# EAGLE design dual_motor_driver_v7 (EAGLE 8.2.2)
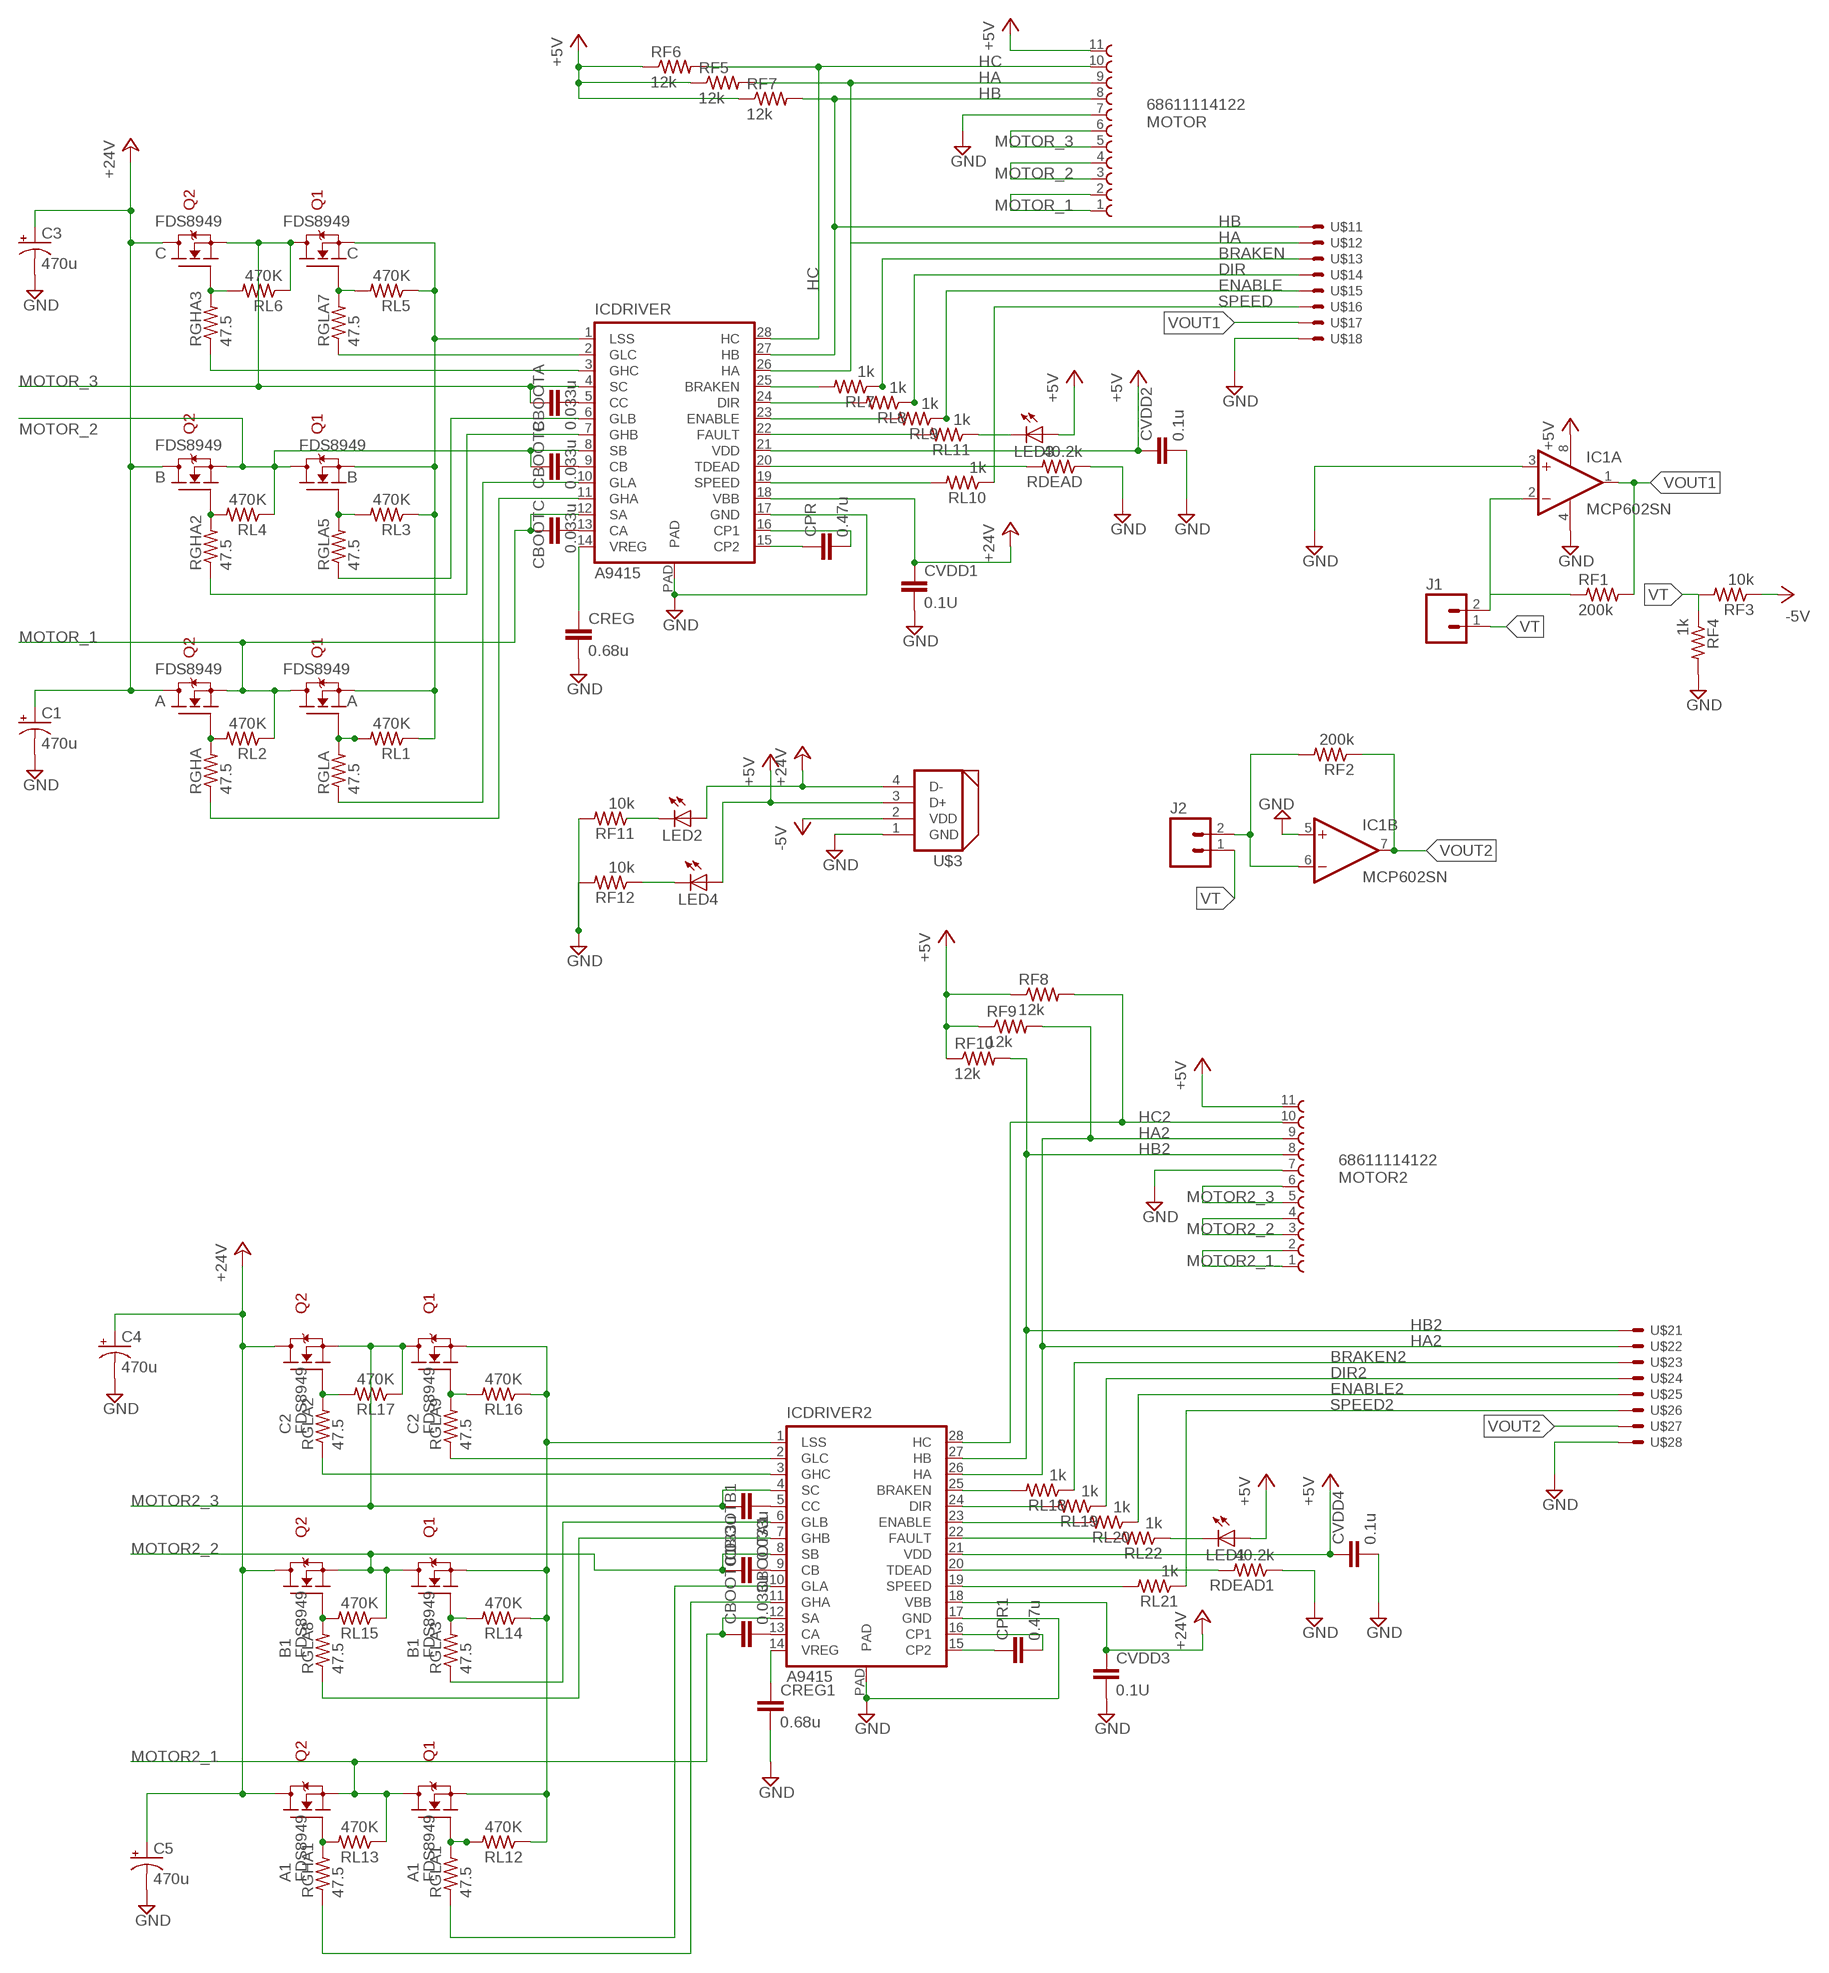
[diagram p0: schematic, sheet 1]

## Parts
A  FDS8949  [SOIC8]
A1  FDS8949  [SOIC8]
B  FDS8949  [SOIC8]
B1  FDS8949  [SOIC8]
C  FDS8949  [SOIC8]
C1  470u  CPOL-US140CLH-1010  [140CLH-1010]
C2  FDS8949  [SOIC8]
C3  470u  CPOL-US140CLH-1010  [140CLH-1010]
C4  470u  CPOL-US140CLH-1010  [140CLH-1010]
C5  470u  CPOL-US140CLH-1010  [140CLH-1010]
CBOOTA  0.033u  C-EUC0805  [C0805]
CBOOTA1  0.033u  C-EUC0805  [C0805]
CBOOTB  0.033u  C-EUC0805  [C0805]
CBOOTB1  0.033u  C-EUC0805  [C0805]
CBOOTC  0.033u  C-EUC0805  [C0805]
CBOOTC1  0.033u  C-EUC0805  [C0805]
CPR  0.47u  C-EUC0805  [C0805]
CPR1  0.47u  C-EUC0805  [C0805]
CREG  0.68u  C-EUC0805  [C0805]
CREG1  0.68u  C-EUC0805  [C0805]
CVDD1  0.1U  C-EUC0805  [C0805]
CVDD2  0.1u  C-EUC0805  [C0805]
CVDD3  0.1U  C-EUC0805  [C0805]
CVDD4  0.1u  C-EUC0805  [C0805]
IC1  MCP602SN  [SO08]
ICDRIVER  A9415  [TSSOP28]
ICDRIVER2  A9415  [TSSOP28]
J1  M02PTH  [1X02]
J2  M02PTH  [1X02]
LED1  LEDCHIPLED_0805  [CHIPLED_0805]
LED2  LEDCHIPLED_0805  [CHIPLED_0805]
LED3  LEDCHIPLED_0805  [CHIPLED_0805]
LED4  LEDCHIPLED_0805  [CHIPLED_0805]
MOTOR  68611114122  [68611114122]
MOTOR2  68611114122  [68611114122]
RDEAD  40.2k  R-US_R0805  [R0805]
RDEAD1  40.2k  R-US_R0805  [R0805]
RF1  200k  R-US_R0805  [R0805]
RF2  200k  R-US_R0805  [R0805]
RF3  10k  R-US_R0805  [R0805]
RF4  1k  R-US_R0805  [R0805]
RF5  12k  R-US_R0805  [R0805]
RF6  12k  R-US_R0805  [R0805]
RF7  12k  R-US_R0805  [R0805]
RF8  12k  R-US_R0805  [R0805]
RF9  12k  R-US_R0805  [R0805]
RF10  12k  R-US_R0805  [R0805]
RF11  10k  R-US_R0805  [R0805]
RF12  10k  R-US_R0805  [R0805]
RGHA  47.5  R-US_R0805  [R0805]
RGHA1  47.5  R-US_R0805  [R0805]
RGHA2  47.5  R-US_R0805  [R0805]
RGHA3  47.5  R-US_R0805  [R0805]
RGLA  47.5  R-US_R0805  [R0805]
RGLA1  47.5  R-US_R0805  [R0805]
RGLA2  47.5  R-US_R0805  [R0805]
RGLA3  47.5  R-US_R0805  [R0805]
RGLA5  47.5  R-US_R0805  [R0805]
RGLA7  47.5  R-US_R0805  [R0805]
RGLA8  47.5  R-US_R0805  [R0805]
RGLA9  47.5  R-US_R0805  [R0805]
RL1  470K  R-US_R0805  [R0805]
RL2  470K  R-US_R0805  [R0805]
RL3  470K  R-US_R0805  [R0805]
RL4  470K  R-US_R0805  [R0805]
RL5  470K  R-US_R0805  [R0805]
RL6  470K  R-US_R0805  [R0805]
RL7  1k  R-US_R0805  [R0805]
RL8  1k  R-US_R0805  [R0805]
RL9  1k  R-US_R0805  [R0805]
RL10  1k  R-US_R0805  [R0805]
RL11  1k  R-US_R0805  [R0805]
RL12  470K  R-US_R0805  [R0805]
RL13  470K  R-US_R0805  [R0805]
RL14  470K  R-US_R0805  [R0805]
RL15  470K  R-US_R0805  [R0805]
RL16  470K  R-US_R0805  [R0805]
RL17  470K  R-US_R0805  [R0805]
RL18  1k  R-US_R0805  [R0805]
RL19  1k  R-US_R0805  [R0805]
RL20  1k  R-US_R0805  [R0805]
RL21  1k  R-US_R0805  [R0805]
RL22  1k  R-US_R0805  [R0805]
U$1  JST8  [JST]
U$2  JST8  [JST]
U$3  DYNAMIXEL_RS485  [DYNAMIXEL_SPOX_04]

## Nets
+5V: CVDD2.1 CVDD4.1 IC1.8(P:V+) ICDRIVER2.21(VDD) ICDRIVER.21(VDD) LED1.A LED3.A LED4.A MOTOR2.11 MOTOR.11 RF5.1 RF6.1 RF7.1 RF8.1 RF9.1 RF10.1 U$3.3(D+)
+24V: A1.5(D2) A1.6(D2) A.5(D2) A.6(D2) B1.5(D2) B1.6(D2) B.5(D2) B.6(D2) C1.+ C2.5(D2) C2.6(D2) C3.+ C4.+ C5.+ C.5(D2) C.6(D2) CVDD1.1 CVDD3.1 ICDRIVER2.18(VBB) ICDRIVER.18(VBB) LED2.A U$3.4(D-)
-5V: RF3.1 U$3.2(VDD)
BRAKEN: RL7.1 U$1.3
BRAKEN2: RL18.1 U$2.3
DIR: RL8.1 U$1.4
DIR2: RL19.1 U$2.4
ENABLE: RL9.1 U$1.5
ENABLE2: RL20.1 U$2.5
GND: A1.1(S1) A.1(S1) B1.1(S1) B.1(S1) C1.- C2.1(S1) C3.- C4.- C5.- C.1(S1) CREG1.2 CREG.2 CVDD1.2 CVDD2.2 CVDD3.2 CVDD4.2 IC1.3(A:+IN) IC1.4(P:V-) IC1.5(B:+IN) ICDRIVER2.1(LSS) ICDRIVER2.17(GND) ICDRIVER2.PAD ICDRIVER.1(LSS) ICDRIVER.17(GND) ICDRIVER.PAD MOTOR2.7 MOTOR.7 RDEAD1.1 RDEAD.1 RF4.2 RF11.2 RF12.2 RL1.1 RL3.1 RL5.1 RL12.1 RL14.1 RL16.1 U$1.8 U$2.8 U$3.1(GND)
HA: ICDRIVER.26(HA) MOTOR.9 RF5.2 U$1.2
HA2: ICDRIVER2.26(HA) MOTOR2.9 RF9.2 U$2.2
HB: ICDRIVER.27(HB) MOTOR.8 RF7.2 U$1.1
HB2: ICDRIVER2.27(HB) MOTOR2.8 RF10.2 U$2.1
HC: ICDRIVER.28(HC) MOTOR.10 RF6.2
HC2: ICDRIVER2.28(HC) MOTOR2.10 RF8.2
MOTOR2_1: A1.3(S2) A1.7(D1) A1.8(D1) CBOOTC1.1 ICDRIVER2.12(SA) MOTOR2.1 MOTOR2.2 RL13.1
MOTOR2_2: B1.3(S2) B1.7(D1) B1.8(D1) CBOOTB1.1 ICDRIVER2.8(SB) MOTOR2.3 MOTOR2.4 RL15.1
MOTOR2_3: C2.3(S2) C2.7(D1) C2.8(D1) CBOOTA1.2 ICDRIVER2.4(SC) MOTOR2.5 MOTOR2.6 RL17.1
MOTOR_1: A.3(S2) A.7(D1) A.8(D1) CBOOTC.1 ICDRIVER.12(SA) MOTOR.1 MOTOR.2 RL2.1
MOTOR_2: B.3(S2) B.7(D1) B.8(D1) CBOOTB.1 ICDRIVER.8(SB) MOTOR.3 MOTOR.4 RL4.1
MOTOR_3: C.3(S2) C.7(D1) C.8(D1) CBOOTA.2 ICDRIVER.4(SC) MOTOR.5 MOTOR.6 RL6.1
N$1: A1.2(G1) RGLA1.2 RL12.2
N$2: A1.4(G2) RGHA1.2 RL13.2
N$3: B1.2(G1) RGLA3.2 RL14.2
N$4: B1.4(G2) RGLA8.2 RL15.2
N$5: C2.2(G1) RGLA9.2 RL16.2
N$6: C2.4(G2) RGLA2.2 RL17.2
N$7: B.2(G1) RGLA5.2 RL3.2
N$8: B.4(G2) RGHA2.2 RL4.2
N$9: ICDRIVER2.11(GHA) RGHA1.1
N$10: ICDRIVER2.10(GLA) RGLA1.1
N$11: ICDRIVER2.6(GLB) RGLA3.1
N$12: ICDRIVER2.7(GHB) RGLA8.1
N$13: CBOOTA1.1 ICDRIVER2.5(CC)
N$14: CBOOTB1.2 ICDRIVER2.9(CB)
N$15: C.2(G1) RGLA7.2 RL5.2
N$16: CPR.1 ICDRIVER.15(CP2)
N$17: ICDRIVER.11(GHA) RGHA.1
N$18: C.4(G2) RGHA3.2 RL6.2
N$19: CREG1.1 ICDRIVER2.14(VREG)
N$20: ICDRIVER.10(GLA) RGLA.1
N$21: CREG.1 ICDRIVER.14(VREG)
N$22: CBOOTC.2 ICDRIVER.13(CA)
N$23: CBOOTC1.2 ICDRIVER2.13(CA)
N$24: ICDRIVER.2(GLC) RGLA7.1
N$25: ICDRIVER.6(GLB) RGLA5.1
N$26: ICDRIVER.7(GHB) RGHA2.1
N$27: ICDRIVER.3(GHC) RGHA3.1
N$28: CBOOTB.2 ICDRIVER.9(CB)
N$29: CPR.2 ICDRIVER.16(CP1)
N$30: ICDRIVER2.2(GLC) RGLA9.1
N$31: CBOOTA.1 ICDRIVER.5(CC)
N$32: A.2(G1) RGLA.2 RL1.2
N$33: A.4(G2) RGHA.2 RL2.2
N$34: ICDRIVER2.3(GHC) RGLA2.1
N$35: CPR1.1 ICDRIVER2.15(CP2)
N$36: CPR1.2 ICDRIVER2.16(CP1)
N$37: ICDRIVER2.19(SPEED) RL21.2
N$38: ICDRIVER2.23(ENABLE) RL20.2
N$39: ICDRIVER2.24(DIR) RL19.2
N$40: ICDRIVER.19(SPEED) RL10.2
N$41: ICDRIVER.23(ENABLE) RL9.2
N$42: ICDRIVER.24(DIR) RL8.2
N$43: ICDRIVER2.25(BRAKEN) RL18.2
N$44: ICDRIVER.25(BRAKEN) RL7.2
N$45: ICDRIVER.20(TDEAD) RDEAD.2
N$46: ICDRIVER.22(FAULT) RL11.2
N$47: LED3.C RL11.1
N$48: LED2.C RF11.1
N$49: ICDRIVER2.20(TDEAD) RDEAD1.2
N$50: ICDRIVER2.22(FAULT) RL22.2
N$51: LED1.C RL22.1
N$52: IC1.2(A:-IN) J1.2 RF1.1
N$59: LED4.C RF12.1
N$82: IC1.6(B:-IN) J2.2 RF2.2
SPEED: RL10.1 U$1.6
SPEED2: RL21.1 U$2.6
VOUT1: IC1.1(A:OUT) RF1.2 U$1.7
VOUT2: IC1.7(B:OUT) RF2.1 U$2.7
VT: J1.1 J2.1 RF3.2 RF4.1

## Library data of the parts
A A1 B B1 C C2 = dedo:FDS8949: Dual N-Channel PowerTrench® MOSFET https://www.fairchildsemi.com/datasheets/FD/FDS8949.pdf
C1 C3-C5 = resistor:CPOL-US: POLARIZED CAPACITOR, American symbol
CBOOTA CBOOTA1 CBOOTB CBOOTB1 CBOOTC CBOOTC1 CPR CPR1 CREG CREG1 CVDD1-CVDD4 = resistor:C-EU: CAPACITOR, European symbol
IC1 = dedo:MCP602: Single Op Amp 2.7V to 6.0V Single Supply CMOS Source: http://ww1.microchip.com/downloads/en/DeviceDoc/21314g.pdf
ICDRIVER ICDRIVER2 = dedo:A9415: A4915 3-Phase MOSFET Driver The A4915 is designed for pulse width modulated (PWM) current control of 3-phase brushless DC motors. The A4915 is capable of high current gate drive for 6 all N-channel power MOSFETs. An internal charge pump ensures gate drive down to 7 V supply and provides limited gate drive down to 5 V. A bootstrap capacitor is used to generate a supply voltage greater than the source voltage of the high side MOSFET, required for N-channel MOSFETs. Details see: http://www.allegromicro.com/~/media/Files/Datasheets/A4915-Datasheet.ashx?la=en
J1 J2 = uchile_robotics_eagle_lib:M02: Standard 2-pin 0.1" header. Use with - straight break away headers ( PRT-00116) - right angle break away headers (PRT-00553) - swiss pins (PRT-00743) - machine pins (PRT-00117) - female headers (PRT-00115) Molex polarized connector foot print use with: PRT-08233 with associated crimp pins and housings. 2.54_SCREWTERM for use with PRT-10571. 3.5mm Screw Terminal footprints for PRT-08084 5mm Screw Terminal footprints for use with PRT-08432
LED1-LED4 = adafruit:LED: LED OSRAM: - CHIPLED LG R971, LG N971, LY N971, LG Q971, LY Q971, LO R971, LY R971 LH N974, LH R974 LS Q976, LO Q976, LY Q976 LO Q996 - Hyper CHIPLED LW Q18S LB Q993, LB Q99A, LB R99A - SideLED LS A670, LO A670, LY A670, LG A670, LP A670 LB A673, LV A673, LT A673, LW A673 LH A674 LY A675 LS A676, LA A676, LO A676, LY A676, LW A676 LS A679, LY A679, LG A679 - Hyper Micro SIDELED® LS Y876, LA Y876, LO Y876, LY Y876 LT Y87S - SmartLED LW L88C, LW L88S LB L89C, LB L89S, LG L890 LS L89K, LO L89K, LY L89K LS L896, LA L896, LO L896, LY L896 - TOPLED LS T670, LO T670, LY T670, LG T670, LP T670 LSG T670, LSP T670, LSY T670, LOP T670, LYG T670 LG T671, LOG T671, LSG T671 LB T673, LV T673, LT T673, LW T673 LH T674 LS T676, LA T676, LO T676, LY T676, LB T676, LH T676, LSB T676, LW T676 LB T67C, LV T67C, LT T67C, LS T67K, LO T67K, LY T67K, LW E67C LS E67B, LA E67B, LO E67B, LY E67B, LB E67C, LV E67C, LT E67C LW T67C LS T679, LY T679, LG T679 LS T770, LO T770, LY T770, LG T770, LP T770 LB T773, LV T773, LT T773, LW T773 LH T774 LS E675, LA E675, LY E675, LS T675 LS T776, LA T776, LO T776, LY T776, LB T776 LHGB T686 LT T68C, LB T68C - Hyper Mini TOPLED® LB M676 - Mini TOPLED Santana® LG M470 LS M47K, LO M47K, LY M47K Source: http://www.osram.convergy.de/
MOTOR MOTOR2 = FPC_Connectors_Flat_Flexible_Cable_rev15c:68611114122: WR-FPC 1.00mm SMT ZIF Horizontal Top Contact, 11 Pins=>Code : Con_FPC_ZIF_1.00_68611114122 <http://katalog.we-online.de/media/images/eican/Con_FPC_ZIF_1.00_6861xx14122_pf2.jpg> Details see: http://katalog.we-online.de/en/em/686_1xx_141_22 Created 2014-07-09, Karrer Zheng 2014 (C) Würth Elektronik
RDEAD RDEAD1 RF1-RF12 RGHA RGHA1-RGHA3 RGLA RGLA1-RGLA3 RGLA5 RGLA7-RGLA9 RL1-RL22 = resistor:R-US_: RESISTOR, American symbol
U$1 U$2 = dedo:JST8
U$3 = uchile_robotics_eagle_lib:DYNAMIXEL_RS485: Dynamixel RS-485 Connector Molex LLC SPOX 4 Male connector Digikey code: WM18888-ND

## Net classes
0 default: clearance 0.205 mm

## Board
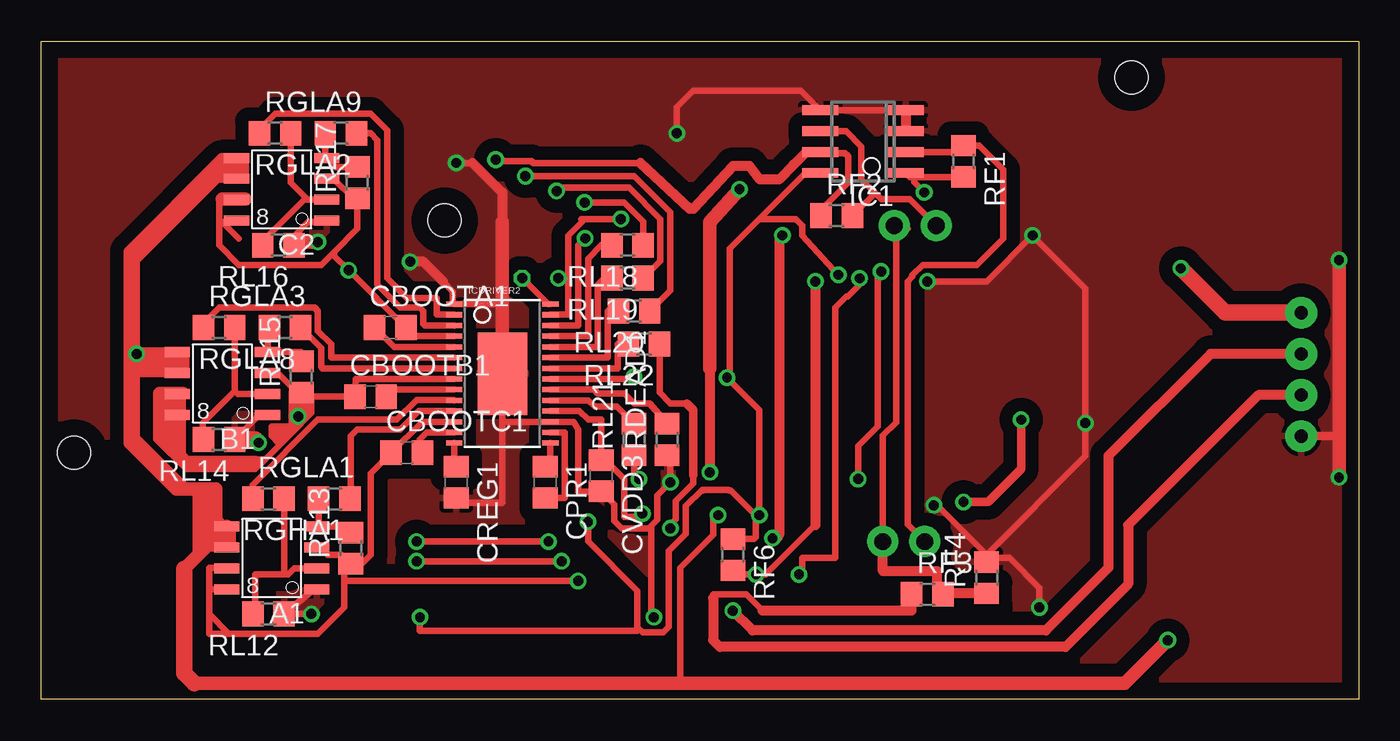
[diagram p1: board, top side]
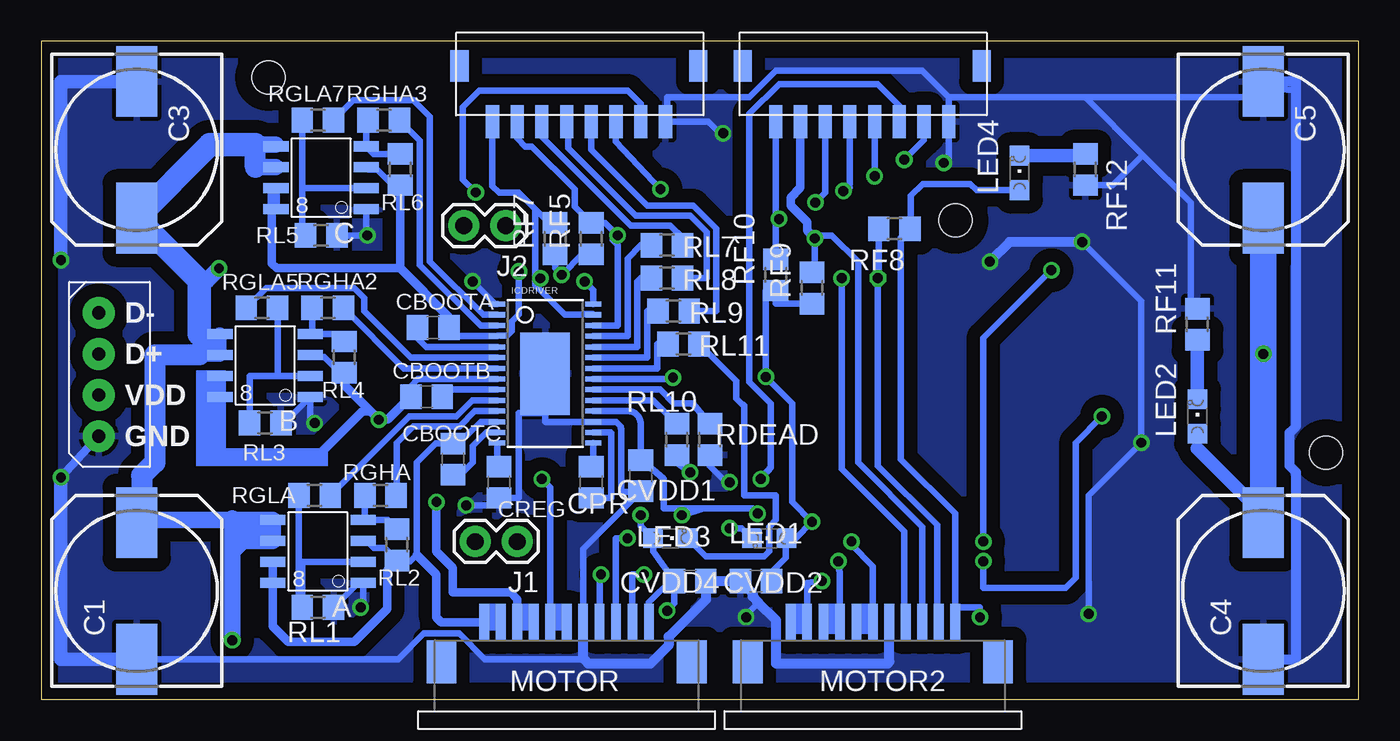
[diagram p2: board, bottom side, seen from below]

Size 80 x 40 mm. Coordinates in mm from the lower left corner, seen from the top.
Outline: 80,0 0,0 0,40 80,40 80,0
Copper layers (1*16): Top 0.035mm / dielectric 1.5mm / Bottom 0.035mm
Design rules "Dedo_v5": minimum track width 10mil, minimum drill 24mil, track to track 0.205mm, track to pad 0.205mm, pad to pad 0.205mm, via to via 0.205mm, smd to smd 8mil, copper to edge 40mil, drill to drill 8mil, minimum pad ring 10mil, minimum via ring 8mil, stop-mask expansion 4mil, vias tented up to drill 0mil, thermal gap 10mil
Holes 2 mm at 66.2,37.8 2,15 24.5,29.1

### Footprints (pad centres in the part's own frame; a part is rotated, then mirrored left to right if it is on the bottom)
SOIC8 = smd 1.524 x 0.61: 1 -2.743,1.905; 2 -2.743,0.635; 3 -2.743,-0.635; 4 -2.743,-1.905; 5 2.743,-1.905; 6 2.743,-0.635; 7 2.743,0.635; 8 2.743,1.905
140CLH-1010 = smd 4.3 x 2.5: + 4.15,0; - -4.15,0
C0805 = smd 1.3 x 1.5: 1 -0.95,0; 2 0.95,0
SO08 = smd 0.6 x 2.2: 1 -1.905,-2.6; 2 -0.635,-2.6; 3 0.635,-2.6; 4 1.905,-2.6; 5 1.905,2.6; 6 0.635,2.6; 7 -0.635,2.6; 8 -1.905,2.6
TSSOP28 = smd 0.305 x 0.991: 1 -4.225,-2.918; 2 -3.575,-2.918; 3 -2.925,-2.918; 4 -2.275,-2.918; 5 -1.625,-2.918; 6 -0.975,-2.918; 7 -0.325,-2.918; 8 0.325,-2.918; 9 0.975,-2.918; 10 1.625,-2.918; 11 2.275,-2.918; 12 2.925,-2.918; 13 3.575,-2.918; 14 4.225,-2.918; 15 4.225,2.918; 16 3.575,2.918; 17 2.925,2.918; 18 2.275,2.918; 19 1.625,2.918; 20 0.975,2.918; 21 0.325,2.918; 22 -0.325,2.918; 23 -0.975,2.918; 24 -1.625,2.918; 25 -2.275,2.918; 26 -2.925,2.918; 27 -3.575,2.918; 28 -4.225,2.918 | smd 5 x 3: PAD 0,0
1X02 = drill 1.016 pad 1.88: 1 0,0; 2 2.54,0
CHIPLED_0805 = smd 1.2 x 1.2: A 0,-1.05; C 0,1.05
68611114122 = smd 0.6 x 2.2: 1 -8.5,1.1; 2 -7.5,1.1; 3 -6.5,1.1; 4 -5.5,1.1; 5 -4.5,1.1; 6 -3.5,1.1; 7 -2.5,1.1; 8 -1.5,1.1; 9 -0.5,1.1; 10 0.5,1.1; 11 1.5,1.1 | smd 1.8 x 2.6: Z1 -11.1,-1.3; Z2 4.1,-1.3
R0805 = smd 1.3 x 1.5: 1 -0.95,0; 2 0.95,0
JST = smd 0.8 x 2: 1 -4.8,-2.7; 2 -3.3,-2.7; 3 -1.8,-2.7; 4 -0.3,-2.7; 5 1.2,-2.7; 6 2.7,-2.7; 7 4.2,-2.7; 8 5.7,-2.7 | smd 1.1 x 1.9: 9 -6.8,0.7; 10 7.7,0.7
DYNAMIXEL_SPOX_04 = drill 0.8 pad 1.93: 1 0,0; 2 2.5,0; 3 5,0; 4 7.5,0

### Placement (x,y rotation side)
A  63.2,9 180 bottom
A1  14,8.6 180 top
B  66.4,20.3 180 bottom
B1  11,19.2 180 top
C  63,31.7 180 bottom
C1  74.2,6.6 90 bottom
C2  14.6,31 180 top
C3  74.2,33.4 270 bottom
C4  5.8,6.6 90 bottom
C5  5.8,33.4 270 bottom
CBOOTA  56.2,22.6 0 bottom
CBOOTA1  21.2,22.6 0 top
CBOOTB  56.6,18.4 0 bottom
CBOOTB1  20,18.4 0 top
CBOOTC  55,14.6 270 bottom
CBOOTC1  22.2,15 0 top
CPR  46.6,13.2 270 bottom
CPR1  30.6,13.2 270 top
CREG  52.2,13.2 270 bottom
CREG1  25.2,13.2 270 top
CVDD1  43.6,13.6 270 bottom
CVDD2  36.6,7.2 180 bottom
CVDD3  34,13.6 270 top
CVDD4  40.6,7.2 0 bottom
IC1  49.9,33.9 90 top
ICDRIVER  49.4,19.8 270 bottom
ICDRIVER2  28,19.8 270 top
J1  51.1,9.6 180 bottom
J2  51.8,28.8 180 bottom
LED1  35.8,9.8 90 bottom
LED2  9.8,17.2 0 bottom
LED3  41.8,9.8 270 bottom
LED4  20.6,32 0 bottom
MOTOR  44.6,3.6 0 bottom
MOTOR2  26,3.6 0 bottom
RDEAD  39.4,15.8 90 bottom
RDEAD1  38,15.8 90 top
RF1  56,32.7 270 top
RF2  48.3,29.4 0 top
RF3  53.8,6.4 0 top
RF4  57.4,7.4 90 top
RF5  46.6,28 90 bottom
RF6  42,8.8 270 top
RF7  48.8,28 90 bottom
RF8  28.2,28.6 180 bottom
RF9  33.2,25 90 bottom
RF10  35.4,25.8 90 bottom
RF11  9.8,22.8 90 bottom
RF12  16.6,32.2 270 bottom
RGHA  59.4,12.4 180 bottom
RGHA1  17.8,12.2 180 top
RGHA2  62.6,23.8 180 bottom
RGHA3  59.2,35.2 180 bottom
RGLA  63.4,12.4 180 bottom
RGLA1  13.8,12.2 0 top
RGLA2  18.2,34.4 180 top
RGLA3  10.8,22.6 0 top
RGLA5  66.6,23.8 0 bottom
RGLA7  63.2,35.2 180 bottom
RGLA8  14.8,22.6 180 top
RGLA9  14.2,34.4 0 top
RL1  63.2,5.6 180 bottom
RL2  58.4,9.4 90 bottom
RL3  66.4,16.8 180 bottom
RL4  61.6,20.8 90 bottom
RL5  63,28.2 180 bottom
RL6  58.2,32.2 90 bottom
RL7  42,27.6 180 bottom
RL8  42,25.6 180 bottom
RL9  41.6,23.6 180 bottom
RL10  41.4,15.8 90 bottom
RL11  41,21.6 180 bottom
RL12  13.8,5.2 180 top
RL13  18.8,9.2 90 top
RL14  10.8,15.8 180 top
RL15  15.8,19.6 90 top
RL16  14.4,27.6 180 top
RL17  19.2,31.4 90 top
RL18  35.6,27.6 180 top
RL19  35.6,25.6 180 top
RL20  36,23.6 180 top
RL21  36,15.8 90 top
RL22  36.6,21.6 180 top
U$1  47.8,37.8 0 bottom
U$2  30.6,37.8 0 bottom
U$3  76.5,16 90 bottom

### Tracks (layer width: path | path; a pad name or v marks a point on that pad's centre or on a via)
+5V  (via drill 0.6)
  Top 0.406: 36.2,4.4 36.2,4.17 23,4.17 v23,5 | 36.2,4.4 36.2,6.61 33.2,9.61 v33.2,10.8 | 43.4,11.19 43.59,11 43.4,11 v43.6,11.2 43.6,17.6 v41.64,19.56 41.8,19.72 41.8,27.4 43.6,29.2 | 43.4,11.19 41.88,12.71 41.74,12.71 41.73,12.72 40.12,12.72 40.11,12.71 | ICDRIVER2.21 35.88,19.48 v36,19.6 | 36.2,4.4 36.51,4.09 37.78,4.09 38.11,4.42 38.11,9.02 39.15,10.06 39.15,11.75 40.11,12.71 | 40.11,12.71 40.2,12.71 | IC1.8 46.4,32 43.6,29.2 | 43.6,29.2 45.8,29.2 46.2,28.8 46.2,28.2 v48.4,25.8 | 43.4,11.19 43.4,9.85 43.3,9.75 RF6.1
  Top 0.61: U$3.3 71,21 64.8,14.8 64.8,8 61,4.2 43.2,4.2 v42,5.4
  Bottom 0.406: 41.66,7.34 42.85,9 LED3.A 43.6,10.55 v43.6,11.2 | 41.66,7.34 CVDD4.1 41.55,5.85 v42,5.4 | MOTOR.11 43.1,5.9 41.66,7.34 | CVDD2.1 35.65,7.75 34.8,8.6 34.8,9.75 LED1.A 34.2,9.8 v33.2,10.8 34.4,12 34.4,18 v36,19.6 36,24.85 RF10.1 35.4,24.05 RF9.1 | ICDRIVER.21 41.73,19.48 v41.64,19.56 | v48.4,25.8 48.6,26 | v23,5 23,5.6 24.5,5.6 MOTOR2.11 24.5,11.3 27.8,14.6 27.8,28.05 RF8.1 27.2,28.65 27.2,30.6 26.48,31.32 23.58,31.32 23.21,30.95 LED4.A | RF7.1 48.8,26.2 v48.4,25.8 | RF5.1 47.15,27.05 v48.4,25.8
+24V  (via drill 0.6)
  Top 0.406: B1.6 7.2,19.84 7.2,21 | 7.2,21 8.26,21 B1.5 | C2.6 10.8,31.64 | 10.8,31.64 10.8,32.8 11.86,32.8 C2.5 | 7.2,21 v5.8,21 | v5.8,21 5.8,15.96 A1.5 10.2,10.51 10.2,9.2 11.26,9.2 A1.6 | 10.8,31.64 5.8,26.64 v5.8,21 | ICDRIVER2.18 32.67,17.52 33.2,17 34,17 CVDD3.1 34.45,14.35 35.4,13.4 35.4,11.1 36.3,11.1 v36.5,11.3 | 41,1 41.03,1 | 38.8,1 38.8,8 40.8,10 40.8,10.9 v41.1,11.2
  Top 0.813: A1.5 8.7,7.95 | 9.3,1 38.8,1 41,1 | 41.03,1 65.8,1 v68.4,3.6
  Top 1.016: 8.7,7.95 8.7,1.6 9.3,1 | U$3.4 71.9,23.5 v69.2,26.2
  Bottom 0.406: 65.74,33.7 C.5 | 67,9.63 A.6 | 65.94,11 A.5 | C1.+ 73.95,11 73.66,11 68.4,11 65.94,11 | C5.+ v5.8,21 5.8,11.67 | 5.8,11.67 C4.+ | 39.8,11.6 42.2,11.6 42.2,13.4 42.65,13.8 CVDD1.1 43.6,16.75 arc-90 44.38,17.52 ICDRIVER.18 | 39.8,11.6 v41.1,11.2 | 39.8,11.6 36.8,11.6 v36.5,11.3 | 65.94,11 | 65.94,11 68.4,8.54 | 6.54,11.98 6.11,11.98 5.8,11.67 | LED2.A 9.8,15.25
  Bottom 0.813: 70.4,22.2 70.4,20.93 B.6 B.5 | 73.9,10.75 C1.+ | 9.8,15.25 6.54,11.98
  Bottom 1.016: C.6 67,32.34 | 67,33.7 65.74,33.7 | 70.4,25.45 69.95,25.45 v69.2,26.2 | 68.4,9.58 68.4,8.54 v68.4,3.6 | 68.4,10.27 68.4,9.58 | 68.4,10.27 68.4,11 | 65.94,10.4 A.5 73.57,10.9 73.66,11 | 65.94,10.4 A.6 68.34,9.63 68.4,9.58 | 65.94,10.4 68.27,10.4 68.4,10.27
  Bottom 1.27: 67,32.34 67,33.7 | 73.9,10.75 73.9,13.6 73.1,14.4 73.1,20.93 70.4,20.93
  Bottom 1.422: 67,33.7 69.75,33.7 C3.+ 70.4,25.45 70.4,22.2
-5V
  Top 0.406: 43.8,5.4 42.8,6.4 40.8,6.4 40.8,6.17
  Top 0.61: U$3.2 73.9,18.5 66,10.6 66,7 62.2,3.2 41.2,3.2 40.8,3.6 40.8,6.17 | 43.8,5.4 52.85,5.4 RF3.1
BRAKEN
  Bottom 0.406: RL7.1 41.05,28.05 41.8,28.8 44.2,28.8 49.6,34.2 U$1.3
BRAKEN2  (via drill 0.6)
  Top 0.406: RL18.1 36.55,29.05 35.4,30.2 v33,30.2
  Bottom 0.406: v33,30.2 32.4,30.8 U$2.3
DIR
  Bottom 0.406: RL8.1 39.6,25.6 39.6,28.4 40.6,29.4 43.9,29.4 48,33.5 48,35 U$1.4
DIR2  (via drill 0.6)
  Top 0.406: RL19.1 37.6,26.65 37.6,29.2 35.7,31.1 31.5,31.1 v31.3,30.9
  Bottom 0.406: 30.9,31.1 v31.3,30.9 30.9,31.3 U$2.4
ENABLE
  Bottom 0.406: RL9.1 39,23.6 39,28.6 40.4,30 43.2,30 46.6,33.4 U$1.5
ENABLE2  (via drill 0.6)
  Top 0.406: RL20.1 38.2,24.85 38.2,29.6 36,31.8 v29.4,31.8
  Bottom 0.406: v29.4,31.8 U$2.5
GND  (via drill 0.6)
  Top 0.152: 54.6,12 54.4,11.8
  Top 0.406: 28,16.88 28,11.95 25.5,11.95 CREG1.2 | 28,16.88 ICDRIVER2.PAD | 28,16.88 ICDRIVER2.17 32.33,16.88 32.6,16.4 32.6,12.6 33.75,12.6 CVDD3.2 34.79,11.86 34.79,10.85 35.25,10.39 36.88,10.39 37.04,10.56 | 26.2,32.6 v25.2,32.6 | RDEAD1.1 38.2,14.65 v38.2,13.2 37.41,12.41 37.41,10.92 37.04,10.56 | 37.04,10.56 37.04,5.16 v37.2,5 | v38.6,34.4 38.6,36 39.6,37 46.1,37 IC1.5 IC1.4 | 57.4,8.8 RF4.2 57.65,8.6 58.8,8.6 60.6,6.8 v60.6,5.6 | 57.4,8.8 54.4,11.8 v54.2,11.8 | A1.1 16.55,6.7 RL12.1 v16.4,5.2 | B1.1 13.24,17.3 RL14.1 | C2.1 17.25,29 16.2,29 15.35,28.15 RL16.1 15.55,27.8 | v13.2,15.6 13,15.8 | 24.4,25.4 25,24.8 25,24.11 ICDRIVER2.1 27.86,24.02 28,23.89 | v53.8,25.4 57.4,25.4 60.18,28.18 | 60.18,28.18 v60.2,28.2 | 57.4,8.8 63.4,14.8 v63.4,16.8 63.4,24.96 60.18,28.18
  Top 0.508: 78.78,16 U$3.1
  Top 0.61: 26.2,32.6 28,30.8 28,29 | IC1.4 IC1.3 | 24.4,25.4 23.2,26.6 v22.4,26.6
  Top 0.813: 28,29 28,23.89 ICDRIVER2.PAD | v78.8,26.7 v78.8,13.5 | 15.55,27.8 v16.8,27.8
  Top 1.016: 13,15.8 RL14.1
  Bottom 0.406: 24.9,36.6 U$2.8 24.9,32.9 v25.2,32.6 | 16.62,36.6 24.9,36.6 | 16.62,36.6 6.75,36.6 C5.- 5.8,37.2 3.8,37 | 24.9,36.6 26.5,38.2 35.4,38.2 37,36.6 42,36.6 42,35.1 U$1.8 39.5,35.1 38.8,34.4 v38.6,34.4 | 49.4,17.4 ICDRIVER.PAD | 49.4,17.4 49.4,16.88 ICDRIVER.17 45.08,16.88 44.8,16.6 44.8,16.46 44.79,16.45 44.79,12.6 43.6,12.6 CVDD1.2 47.1,9.15 MOTOR.7 | 49.4,17.4 51,17.4 51,12.25 CREG.2 52.65,11.8 v54.2,11.8 | RDEAD.1 39.4,14.2 38.4,13.2 v38.2,13.2 | v37.2,5 37.2,5.13 36.45,5.88 | 46.8,2.2 47.05,2.45 53.07,2.45 54.63,4.01 56.77,4.01 58.33,2.45 C1.- | RL3.1 65.25,16.8 B.1 63.66,17.06 v63.4,16.8 | 13.11,33.09 10.2,30.18 10.2,24.15 RF11.2 | 13.11,33.09 16.62,36.6 | RF12.2 14.94,31.25 13.11,33.09 | v16.8,27.8 13.2,24.2 v13.2,15.6 16.4,12.4 v16.4,5.2 | RL1.1 60.76,7.09 A.1 60.46,5.74 v60.6,5.6 | ICDRIVER.1 52.42,24.02 v53.8,25.4 | C.1 60.26,28.26 v60.2,28.2 RL5.1
  Bottom 0.508: v78.8,13.5 U$3.1
  Bottom 0.61: C4.- 3.8,2.45 3.8,13.8 4.2,14.2 4.2,16.2 3.8,16.6 3.8,37.55 C5.- | MOTOR.7 47.1,2.5 46.8,2.2 43,2.2 41.91,3.29 41.91,3.81 39.65,6.07 CVDD4.2 CVDD2.2 36.81,6.46 36.81,6.24 36.45,5.88 35.4,4.83 35.4,2.2 28.6,2.2 28.5,2.3 MOTOR2.7 | v16.8,27.8 21.2,27.8 v22.4,26.6
  Bottom 0.813: v78.8,26.7 78.8,37.55 C3.- | v78.8,13.5 78.8,2.45 C1.-
  pour Bottom (isolate 0.813): 80,0 0,0 0,40 80,40
  pour Top (isolate 0.813): 80,0 0,0 0,40 80,40
HA  (via drill 0.6)
  Top 0.406: 44.8,10 44.8,9.8 v44.4,9.8
  Top 0.61: 44.8,10 44.8,28.2 v45,28.2
  Bottom 0.406: ICDRIVER.26 45,22.73 45,27.6 45.3,27.9 v45,28.2 45.75,28.95 RF5.2 47.6,29.95 47.6,31 50.2,33.6 50.6,33.6 51.1,34.1 U$1.2 51.2,35 | MOTOR.9 45.1,9.8 v44.4,9.8
HA2  (via drill 0.6)
  Top 0.406: ICDRIVER2.26 32.6,22.73 32.6,27.6 v33.02,28.02 33.2,28.2
  Bottom 0.406: MOTOR2.9 26.5,10.5 30.4,14.4 30.4,26.6 32,28.2 32.85,28.2 v33.02,28.02 33.02,26.13 RF9.2
  Bottom 0.508: U$2.2 33.9,31.1 34.5,30.5 34.5,30 33.5,29 33.5,28.5 v33.02,28.02 33,28
HB  (via drill 0.6)
  Top 0.406: v46,7.6 v46.01,7.6 46.2,7.6 46.2,8.6 48.2,8.6 48.2,23.8 48.89,24.49 48.98,24.49 49.68,25.19 v49.69,25.59
  Bottom 0.406: ICDRIVER.27 46.52,23.41 47.1,23.41 47.11,23.4 48.2,23.4 49.99,25.19 | MOTOR.8 46.1,7.51 v46.01,7.6 | U$1.1 52.6,31.2 52.2,30.8 51,30.8 49.99,29.79 | RF7.2 49.15,28.95 49.99,29.79 | 49.99,25.19 49.99,29.79 | v49.69,25.59 49.99,25.19
HB2  (via drill 0.6)
  Top 0.406: ICDRIVER2.27 32,23.38 32,25.6 | 32,25.6 32,28.2 33,29.2 | 33,29.2 v35.2,29.2 | v31.4,25.6 32,25.6 | 32.8,29.2 33,29.2
  Bottom 0.406: 35.4,29.4 U$2.1 | 35.4,29.4 v35.2,29.2 | v31.4,25.6 31.4,14 27.6,10.2 27.6,4.8 MOTOR2.8 | RF10.2 35.4,29.4
HC  (via drill 0.6)
  Top 0.406: 47,10.6 44,7.6 v43.4,7.6 42.25,7.6 RF6.2
  Top 0.61: v47,25.4 47,10.6
  Bottom 0.406: v47,25.4 46.48,24.88 ICDRIVER.28 | MOTOR.10 44.1,7.6 v43.4,7.6
HC2  (via drill 0.6)
  Top 0.406: ICDRIVER2.28 30.77,24.02 v29.2,25.6
  Bottom 0.406: MOTOR2.10 25.6,4.8 25.6,10.6 29.2,14.2 v29.2,25.6 29.15,25.65 RF8.2
MOTOR2_1  (via drill 0.6)
  Top 0.406: RL13.1 18.25,8.8 17.4,8.8 16.96,9.23 A1.3 | A1.8 10.2,6.7 | 10.2,6.7 10.2,8 11.26,8 A1.7 | ICDRIVER2.12 23.12,16.88 CBOOTC1.1 20,13.75 20,8.8 19.45,8.25 RL13.1 | 10.2,6.7 10.2,5.2 | 10.2,5.2 11.4,4 | 11.4,4 16.8,4 18.4,5.6 18.4,7.17 | 18.4,7.17 18.4,7.85 RL13.1 | 10.2,5.2 10.2,4 11.4,4 | v32.6,7.2 18.43,7.2 18.4,7.17
  Bottom 0.406: MOTOR2.2 33.5,7.1 v32.6,7.2
  Bottom 0.508: MOTOR2.1 MOTOR2.2
MOTOR2_2  (via drill 0.6)
  Top 0.406: RL15.1 15.55,18.65 14.4,19.8 13.78,19.8 B1.3 | B1.7 7.2,18.57 7.2,17.2 | 7.2,17.2 8.26,17.2 B1.8 | RL15.1 15.2,18.65 15.2,16.6 | 19.09,18.65 CBOOTB1.1 | ICDRIVER2.8 19.09,19.48 CBOOTB1.1 | 7.2,17.2 7.2,16.4 7.2,16.2 8.8,14.6 13.6,14.6 | 13.6,14.6 15.2,16.2 | 15.2,16.2 15.2,16.6 | RL15.1 16.05,18.4 16.4,18.4 | 16.4,18.4 CBOOTB1.1 | 14.2,16.2 14.6,16.6 | 14.6,16.6 15.2,16.6 | 13.6,14.6 13,14 8.8,14 7,15.8 7,16.4 | 14.6,16.6 14,16.6 14,16 14.4,15.6 14.4,15.8 15,16.4 14.6,16.4 14.2,16 | 15.2,16.2 16.4,17.4 16.4,18.4 | 16.4,18.4 15.4,17.4 15.4,16.6 16.2,17.4 16.2,17.8 v15.6,17.2 15.6,18 | 8.6,14.6 8.6,18.4 8.2,18 8.2,15 7.8,15.4 7.8,17 | v31.6,8.4 v22.8,8.4
  Top 0.813: 8.6,18.6 7.2,18.6 7.2,16.4 7.2,16 8.2,15 8.6,14.6 8.8,14.4 13,14.4
  Bottom 0.406: MOTOR2.4 31.5,7.7 v31.6,8.4 | v22.8,8.4 22.8,6.8 17.8,6.8 17.2,7.4 17.2,15.6 v15.6,17.2 15.4,17.4
  Bottom 0.508: MOTOR2.3 MOTOR2.4
MOTOR2_3  (via drill 0.6)
  Top 0.406: RL17.1 18.95,30.45 17.8,31.6 17.38,31.6 C2.3 | ICDRIVER2.4 22.68,22.07 CBOOTA1.2 v18.66,26.09 17.8,26.95 17.8,27.2 | RL17.1 19.2,29.95 | 10.8,29 10.8,30.36 C2.7 | 10.8,29 11,29 | 11,29 11.86,29 C2.8 | 10.8,29 10.8,27.6 12,26.4 17,26.4 17.8,27.2 | 17.8,27.2 19.2,28.6 RL17.1 | 12,28 11,29 | v30.8,9.6 v22.8,9.6
  Bottom 0.406: MOTOR2.6 29.5,8.1 30.8,9.4 v30.8,9.6 | v22.8,9.6 22.8,21.95 v18.66,26.09
  Bottom 0.508: MOTOR2.5 MOTOR2.6
MOTOR_1
  Bottom 0.152: A.8 A.7
  Bottom 0.406: A.3 60.23,9.63 59.8,9.2 59.15,9.2 RL2.1 58.35,8.4 57.6,8.4 57.2,8.8 57.2,14.4 56.05,15.55 CBOOTC.1 54.55,16 54.2,16 53.33,16.88 ICDRIVER.12
  Bottom 0.508: A.7 65.94,4.44 65,3.5 61,3.5 59,5.5 59,7.85 RL2.1 | MOTOR.2 MOTOR.1 55.7,4.7 56,5 56,7.6 57.2,8.8
MOTOR_2  (via drill 0.6)
  Top 0.508: v56,12 57.5,12 59.5,14 v59.5,17
  Bottom 0.406: RL4.1 61.85,19.85 62.8,20.8 63.52,20.8 B.3 | ICDRIVER.8 57.12,19.48 57.6,19 57.6,18.55 CBOOTB.1
  Bottom 0.508: MOTOR.4 MOTOR.3 51.1,6.1 51.5,6.5 55,6.5 55,8 56,9 v56,12 | CBOOTB.1 58.95,17 v59.5,17 60,17.5 | RL4.1 61.6,19.1 60,17.5 | B.8 B.7 69.5,19.31 69.5,15 63,15 60.5,17.5 60,17.5
MOTOR_3  (via drill 0.6)
  Top 0.406: v49.6,13.4 49.6,15.4 50.8,16.6 50.8,25.8 v51,26 51.2,26.2
  Bottom 0.152: 65.74,29.85 C.8
  Bottom 0.406: CBOOTA.2 55.45,22.07 ICDRIVER.4 52.28,22.11 51.7,22.11 51.41,22.4 51.41,22.98 51,23.39 v51,26 | RL6.1 58.65,31.25 59.6,32.2 60.12,32.2 C.3 | MOTOR.5 49.1,12.9 v49.6,13.4
  Bottom 0.508: MOTOR.6 MOTOR.5 | 58.2,26.2 RL6.1 | CBOOTA.2 55.25,23.25 58.2,26.2 | 65.74,29.85 C.7 66,30.81 66,26.5 65.7,26.2 58.2,26.2
N$1
  Top 0.406: A1.2 15.37,7.96 15,7.6 14.75,7.6 | 14.75,7.6 13,7.6 13,5.65 RL12.2 | RGLA1.2 14.75,7.6
N$2
  Top 0.406: RGHA1.2 16.85,10.61 A1.4 18.45,10.51 RL13.2
N$3
  Top 0.406: RGLA3.2 11.75,18.75 | 11.75,18.75 9.8,16.8 9.8,15.85 RL14.2 | B1.2 11.94,18.57 11.75,18.75
N$4
  Top 0.406: RL15.2 15.8,21.11 B1.4 13.74,22.6 RGLA8.2
N$5
  Top 0.406: RL16.2 13.45,27.85 15.96,30.36 16.2,30.36 | 16.2,30.36 C2.2 | RGLA9.2 15.15,31.41 16.2,30.36
N$6
  Top 0.406: RGLA2.2 17.25,33 C2.4 17.9,32.35 RL17.2
N$7
  Bottom 0.406: RGLA5.2 65.65,19.66 | 65.65,19.66 B.2 | RL3.2 67.35,19.66 65.65,19.66
N$8
  Bottom 0.406: RL4.2 61.6,22.2 B.4 63.55,22.2 RGHA2.2
N$9
  Top 0.406: ICDRIVER2.11 22.93,17.52 21.8,16.4 19.2,16.4 18.8,16 18.8,12.25 RGHA1.1
N$10
  Top 0.406: ICDRIVER2.10 25.06,18.2 22.8,18.2 21.6,17 16.8,17 12.85,13.05 RGLA1.1
N$11
  Top 0.406: RGLA3.1 9.85,22.85 10.8,23.8 16.6,23.8 16.8,23.6 16.8,22.4 17.6,21.6 17.6,20.8 17.62,20.77 ICDRIVER2.6
N$12
  Top 0.406: RGLA8.1 17,21.35 17,20.2 17.07,20.12 ICDRIVER2.7
N$13
  Top 0.406: ICDRIVER2.5 21.43,21.43 CBOOTA1.1
N$14
  Top 0.406: ICDRIVER2.9 20.99,18.82 CBOOTB1.2
N$15
  Bottom 0.406: RGLA7.2 64.15,31 | 64.15,31 64.15,28.4 RL5.2 | C.2 64.08,31.07 64.15,31
N$16
  Bottom 0.406: CPR.1 46.48,14.15 ICDRIVER.15
N$17
  Bottom 0.406: ICDRIVER.11 53.67,17.52 54.6,16.6 57.4,16.6 58.4,15.6 58.4,12.45 RGHA.1
N$18
  Bottom 0.406: RGHA3.2 60.26,35.09 C.4 59.8,33.15 RL6.2
N$19
  Top 0.406: CREG1.1 25.08,14.27 ICDRIVER2.14
N$20
  Bottom 0.406: ICDRIVER.10 53.83,18.18 54.8,17.2 57.65,17.2 RGLA.1
N$21
  Bottom 0.406: ICDRIVER.14 52.32,14.15 CREG.1
N$22
  Bottom 0.406: ICDRIVER.13 52.98,16.23 53.8,15.4 53.8,14.4 54.4,13.8 55.15,13.8 CBOOTC.2
N$23
  Top 0.406: ICDRIVER2.13 23.43,16.23 23,15.8 23,15.15 CBOOTC1.2
N$24
  Bottom 0.406: ICDRIVER.2 53.17,23.38 56.4,26.6 56.4,35.4 57.4,36.4 61.05,36.4 RGLA7.1
N$25
  Bottom 0.406: ICDRIVER.6 57.58,20.77 60.4,23.6 60.4,24.4 61,25 66.35,25 RGLA5.1
N$26
  Bottom 0.406: ICDRIVER.7 57.98,20.12 RGHA2.1
N$27
  Bottom 0.406: ICDRIVER.3 53.33,22.73 57,26.4 57,33.95 RGHA3.1
N$28
  Bottom 0.406: ICDRIVER.9 55.85,18.82 CBOOTB.2
N$29
  Bottom 0.406: CPR.2 45.4,12.25 45.4,16.2 45.42,16.23 ICDRIVER.16
N$30
  Top 0.406: ICDRIVER2.2 24.02,23.38 24.02,24.4 22.2,24.4 21,25.6 21,34.6 20,35.6 14.2,35.6 13.2,34.6 13.2,34.45 RGLA9.1
N$31
  Bottom 0.406: ICDRIVER.5 56.62,21.43 57.2,22 57.2,22.55 CBOOTA.1
N$32
  Bottom 0.406: RGLA.2 64.35,5.8 RL1.2 64.15,8.37 A.2
N$33
  Bottom 0.406: RL2.2 58.95,10.9 A.4 60.35,11.01 RGHA.2
N$34
  Top 0.406: ICDRIVER2.3 23.27,22.73 23.2,22.8 23.2,23.6 23,23.8 21.8,23.8 20.4,25.2 20.4,34 20,34.4 RGLA2.1
N$35
  Top 0.406: CPR1.1 30.92,14.15 ICDRIVER2.15
N$36
  Top 0.406: CPR1.2 31.8,12.25 31.8,16.2 31.77,16.23 ICDRIVER2.16
N$37
  Top 0.406: ICDRIVER2.19 33.23,18.18 33.6,17.8 34.95,17.8 RL21.2
N$38
  Top 0.406: ICDRIVER2.23 34.4,20.77 34.4,23.6 RL20.2
N$39
  Top 0.406: ICDRIVER2.24 33.8,21.43 33.8,25.2 34.2,25.6 RL19.2
N$40
  Bottom 0.406: ICDRIVER.19 42.83,18.18 RL10.2
N$41
  Bottom 0.406: ICDRIVER.23 43.2,20.77 43.2,23.6 RL9.2
N$42
  Bottom 0.406: ICDRIVER.24 43.8,21.43 43.8,25.4 43.6,25.6 RL8.2
N$43
  Top 0.406: ICDRIVER2.25 33.2,22.07 33.2,26.8 34,27.6 RL18.2
N$44
  Bottom 0.406: ICDRIVER.25 44.4,22.07 44.4,26.8 43.6,27.6 RL7.2
N$45
  Bottom 0.406: ICDRIVER.20 42.42,18.82 41.6,18 40.45,18 RDEAD.2
N$46
  Bottom 0.406: ICDRIVER.22 42.6,20.12 42.6,21.6 RL11.2
N$47
  Bottom 0.406: RL11.1 37.8,19.35 37.8,18.3 37.4,17.9 arc90 37.3,17.8 37.3,12.4 35.4,12.4 35.4,10.9 35.8,10.5 35.8,9 36.1,8.7 39.65,8.7 LED3.C
N$48
  Bottom 0.813: RF11.1 LED2.C
N$49
  Top 0.406: RDEAD1.2 36.95,18 36,18 35.4,18.6 33.8,18.6 33.58,18.82 ICDRIVER2.20
N$50
  Top 0.406: ICDRIVER2.22 35,20.12 35,21.6 RL22.2
N$51  (via drill 0.6)
  Top 0.406: RL22.1 37.55,18.65 38.2,18 39.2,18 | 39.6,13.6 39.6,13.14 38.54,12.07 38.54,10.94 38,10.4 v38.2,10.4
  Top 0.508: 39.6,13.6 39.6,17.6 39.2,18
  Bottom 0.406: v38.2,10.4 37.45,10.4 LED1.C
N$52
  Top 0.406: IC1.2 55.62,33.27 RF1.1 56.95,33.65 58.4,32.2 58.4,28 56.8,26.4 53.51,26.4 52.89,25.78 52.89,25.69 52.6,25.4 52.6,10.64 J1.2 53.6,9.6 53.3,9.9
N$59
  Bottom 0.406: 16.7,33.05 RF12.1
  Bottom 0.813: LED4.C 16.7,33.05
N$66
  Top 0.813: 12.4,30.4 11,30.4
N$78
  Top 0.813: 10.6,10.8 10.6,12.8 8.2,12.8 5.4,15.6 5.4,27.2 11,32.8 12.2,32.8 12.2,31.8 10.6,31.8 5.8,27
N$79
  Bottom 0.406: 69.6,22 69.6,21.4 69.8,21.4 69.8,21.8
N$82
  Top 0.406: IC1.6 48.87,34.53 49.8,33.6 49.8,31.6 50.6,30.8 | 50.6,30.8 51,30.4 52.74,30.4 J2.2 | RF2.2 50.6,30.75 50.6,30.8
N$87
  Bottom 0.813: 5.4,27.4 5.4,12.8 6.2,12.8 6.2,27.2
SPEED  (via drill 0.6)
  Top 0.61: 40.6,20.1 v40.6,13.8
  Top 0.813: v42.4,31 40.6,29 40.6,20.1
  Bottom 0.406: U$1.6 45.1,33.9 v42.4,31 | RL10.1 41.4,14.4 v40.6,13.8
SPEED2  (via drill 0.6)
  Top 0.406: v36.3,13.4 36,13.8 RL21.1
  Bottom 0.406: U$2.6 27.8,35.2 27.8,36 29.2,37.4 35.2,37.4 37,35.6 37,19.3 35.7,18 35.7,14.1 v36.3,13.4
VOUT1  (via drill 0.6)
  Top 0.406: RF1.2 53,31.75 | 53,31.75 52.74,31.75 IC1.1 | 53,31.75 53,31.43 v53.61,30.81
  Bottom 0.406: U$1.7 43.6,36.2 44.4,37 53.4,37 54.4,36 54.4,31.6 v53.61,30.81 v53.6,30.8 53.6,31
VOUT2  (via drill 0.6)
  Top 0.406: 36.4,32.6 29.89,32.6 29.78,32.71 27.69,32.71 v27.6,32.8 | IC1.7 47.37,33.2 48.8,33.2 49,33 49,31.4 47.35,29.75 RF2.1
  Top 0.61: IC1.7 46.45,33.27 45.69,32.51 45.69,32.49 44.8,31.6 43.63,31.6 43.02,32.41 42.01,32.41 39.6,29.8 39.4,29.8 36.4,32.6
  Bottom 0.406: U$2.7 26.4,34 v27.6,32.8
VT
  Top 0.406: J1.1 51.1,16.04 51.91,16.85 51.91,27.91 52.6,28.6 52,28.6 J2.1
  Top 0.61: J1.1 51.1,7.8 54.4,7.8 54.4,6.4 RF3.2 54.75,6.45 RF4.1
(copper drawn outside any net)
  shapes: Bottom area x8, Top area x7